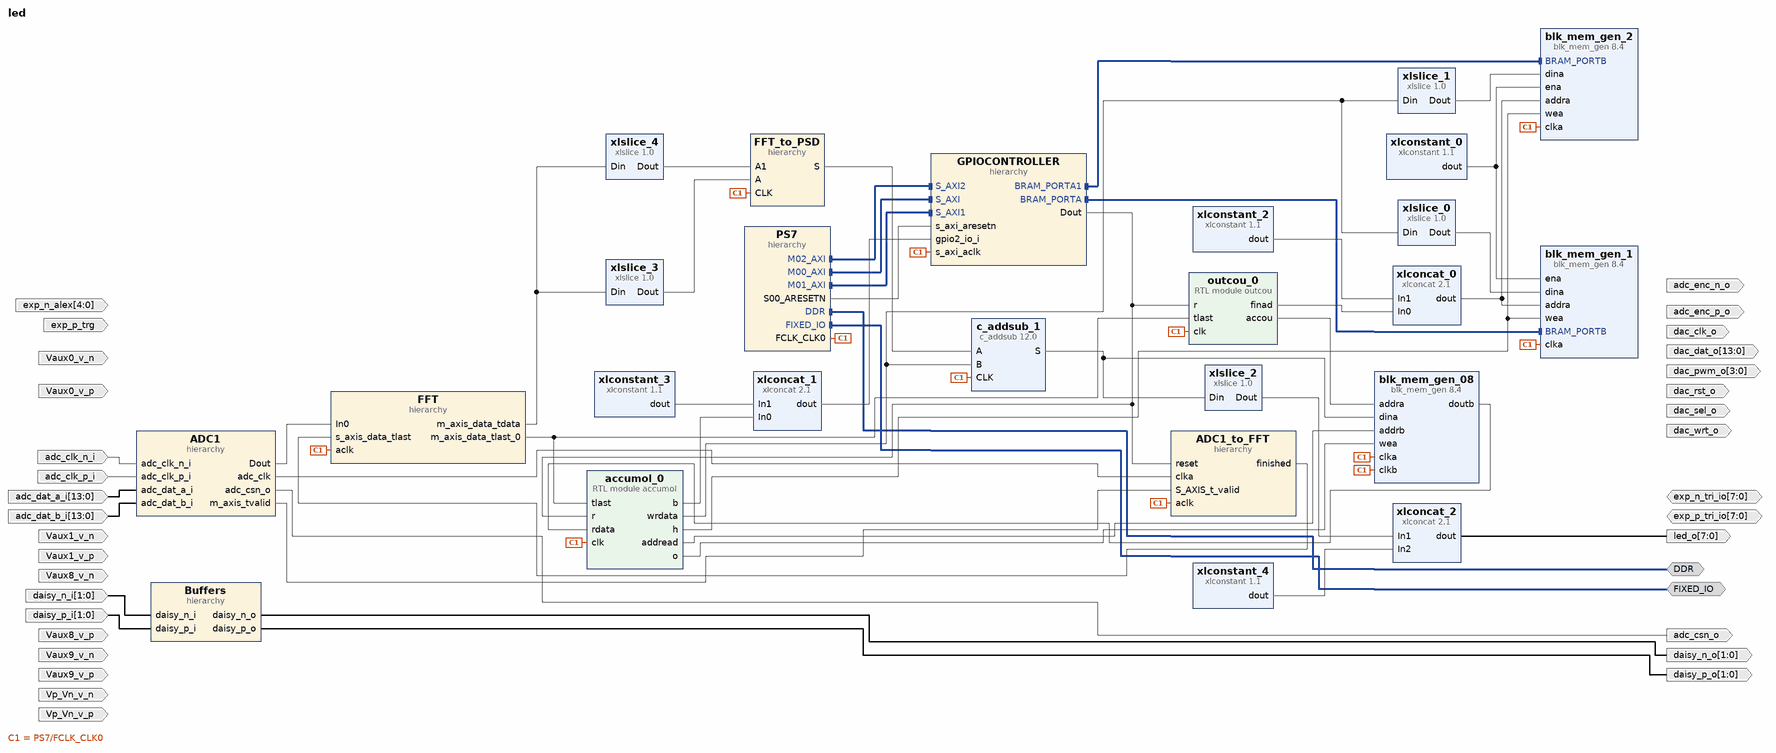
[diagram p0: block diagram of the top level]
# Vivado block design led, xc7z010clg400-1, Vivado 2024.2
create_bd_design led

create_bd_intf_port -mode Master -vlnv xilinx.com:interface:ddrx_rtl:1.0 DDR
create_bd_intf_port -mode Master -vlnv xilinx.com:display_processing_system7:fixedio_rtl:1.0 FIXED_IO
create_bd_port -dir I -from 13 -to 0 adc_dat_a_i
create_bd_port -dir I -from 13 -to 0 adc_dat_b_i
create_bd_port -dir I -type clk adc_clk_n_i
set_property -dict {CONFIG.FREQ_HZ 125000000} [get_bd_ports adc_clk_n_i]
create_bd_port -dir I -type clk adc_clk_p_i
set_property -dict {CONFIG.FREQ_HZ 125000000} [get_bd_ports adc_clk_p_i]
create_bd_port -dir I -from 1 -to 0 -type clk daisy_p_i
set_property -dict {CONFIG.FREQ_HZ 100000000} [get_bd_ports daisy_p_i]
create_bd_port -dir I -from 1 -to 0 -type clk daisy_n_i
set_property -dict {CONFIG.FREQ_HZ 100000000} [get_bd_ports daisy_n_i]
create_bd_port -dir O -from 1 -to 0 -type clk daisy_n_o
create_bd_port -dir O -from 1 -to 0 -type clk daisy_p_o
create_bd_port -dir O -from 7 -to 0 led_o
create_bd_port -dir O -from 13 -to 0 dac_dat_o
create_bd_port -dir O -from 3 -to 0 dac_pwm_o
create_bd_port -dir IO -from 7 -to 0 exp_n_tri_io
create_bd_port -dir IO -from 7 -to 0 exp_p_tri_io
create_bd_port -dir O adc_enc_n_o
create_bd_port -dir O adc_enc_p_o
create_bd_port -dir O dac_clk_o
create_bd_port -dir O dac_rst_o
create_bd_port -dir O dac_sel_o
create_bd_port -dir O dac_wrt_o
create_bd_port -dir O adc_csn_o
create_bd_port -dir I Vaux0_v_p
create_bd_port -dir I Vaux0_v_n
create_bd_port -dir I Vaux1_v_p
create_bd_port -dir I Vaux1_v_n
create_bd_port -dir I Vaux8_v_p
create_bd_port -dir I Vaux8_v_n
create_bd_port -dir I Vaux9_v_p
create_bd_port -dir I Vaux9_v_n
create_bd_port -dir I -type data Vp_Vn_v_p
create_bd_port -dir I -type data Vp_Vn_v_n
create_bd_port -dir I -type data exp_p_trg
create_bd_port -dir I -from 4 -to 0 -type data exp_n_alex

create_bd_cell -type hier PS7
create_bd_cell -type hier GPIOCONTROLLER
create_bd_cell -type hier Buffers
create_bd_cell -type hier ADC1
create_bd_cell -type hier ADC1_to_FFT
create_bd_cell -type hier FFT
create_bd_cell -type ip -vlnv xilinx.com:ip:c_addsub:12.0 c_addsub_1
set_property -dict [list \
  CONFIG.A_Width 64 \
  CONFIG.B_Value 0000000000000000000000000000000000000000000000000000000000000000 \
  CONFIG.B_Width 64 \
  CONFIG.CE false \
  CONFIG.Implementation Fabric \
  CONFIG.Latency 1 \
  CONFIG.Out_Width 64 \
] [get_bd_cells c_addsub_1]
create_bd_cell -type hier FFT_to_PSD
create_bd_cell -type ip -vlnv xilinx.com:ip:blk_mem_gen:8.4 blk_mem_gen_08
set_property -dict [list \
  CONFIG.Enable_A Always_Enabled \
  CONFIG.Enable_B Always_Enabled \
  CONFIG.Memory_Type Simple_Dual_Port_RAM \
  CONFIG.Write_Depth_A 1024 \
  CONFIG.Write_Width_A 64 \
  CONFIG.use_bram_block Stand_Alone \
] [get_bd_cells blk_mem_gen_08]
create_bd_cell -type module -reference outcou outcou_0
create_bd_cell -type ip -vlnv xilinx.com:ip:xlconcat:2.1 xlconcat_0
set_property -dict {CONFIG.IN0_WIDTH 12 CONFIG.IN1_WIDTH 20 CONFIG.IN2_WIDTH 20 CONFIG.NUM_PORTS 2} [get_bd_cells xlconcat_0]
create_bd_cell -type ip -vlnv xilinx.com:ip:xlconstant:1.1 xlconstant_0
create_bd_cell -type ip -vlnv xilinx.com:ip:xlconstant:1.1 xlconstant_2
set_property -dict {CONFIG.CONST_VAL 0 CONFIG.CONST_WIDTH 20} [get_bd_cells xlconstant_2]
create_bd_cell -type ip -vlnv xilinx.com:ip:xlconcat:2.1 xlconcat_1
set_property -dict {CONFIG.IN1_WIDTH 31} [get_bd_cells xlconcat_1]
create_bd_cell -type ip -vlnv xilinx.com:ip:xlconstant:1.1 xlconstant_3
set_property -dict {CONFIG.CONST_VAL 0 CONFIG.CONST_WIDTH 31} [get_bd_cells xlconstant_3]
create_bd_cell -type ip -vlnv xilinx.com:ip:blk_mem_gen:8.4 blk_mem_gen_1
set_property -dict [list \
  CONFIG.Memory_Type True_Dual_Port_RAM \
  CONFIG.Write_Width_A 32 \
  CONFIG.use_bram_block BRAM_Controller \
] [get_bd_cells blk_mem_gen_1]
create_bd_cell -type module -reference accumol accumol_0
create_bd_cell -type ip -vlnv xilinx.com:ip:xlslice:1.0 xlslice_2
set_property -dict {CONFIG.DIN_FROM 2 CONFIG.DIN_TO 2 CONFIG.DIN_WIDTH 64} [get_bd_cells xlslice_2]
create_bd_cell -type ip -vlnv xilinx.com:ip:xlconcat:2.1 xlconcat_2
set_property -dict {CONFIG.IN2_WIDTH 6 CONFIG.NUM_PORTS 3} [get_bd_cells xlconcat_2]
create_bd_cell -type ip -vlnv xilinx.com:ip:xlconstant:1.1 xlconstant_4
set_property -dict {CONFIG.CONST_VAL 11 CONFIG.CONST_WIDTH 6} [get_bd_cells xlconstant_4]
create_bd_cell -type ip -vlnv xilinx.com:ip:xlslice:1.0 xlslice_3
set_property -dict {CONFIG.DIN_FROM 31 CONFIG.DIN_WIDTH 64} [get_bd_cells xlslice_3]
create_bd_cell -type ip -vlnv xilinx.com:ip:xlslice:1.0 xlslice_4
set_property -dict {CONFIG.DIN_FROM 63 CONFIG.DIN_TO 32 CONFIG.DIN_WIDTH 64} [get_bd_cells xlslice_4]
create_bd_cell -type ip -vlnv xilinx.com:ip:xlslice:1.0 xlslice_0
set_property -dict {CONFIG.DIN_FROM 31 CONFIG.DIN_WIDTH 64} [get_bd_cells xlslice_0]
create_bd_cell -type ip -vlnv xilinx.com:ip:xlslice:1.0 xlslice_1
set_property -dict {CONFIG.DIN_FROM 63 CONFIG.DIN_TO 32 CONFIG.DIN_WIDTH 64} [get_bd_cells xlslice_1]
create_bd_cell -type ip -vlnv xilinx.com:ip:blk_mem_gen:8.4 blk_mem_gen_2
set_property -dict [list \
  CONFIG.Memory_Type True_Dual_Port_RAM \
  CONFIG.Write_Width_A 32 \
  CONFIG.use_bram_block BRAM_Controller \
] [get_bd_cells blk_mem_gen_2]

# ---- hierarchy /PS7 ----
current_bd_instance /PS7
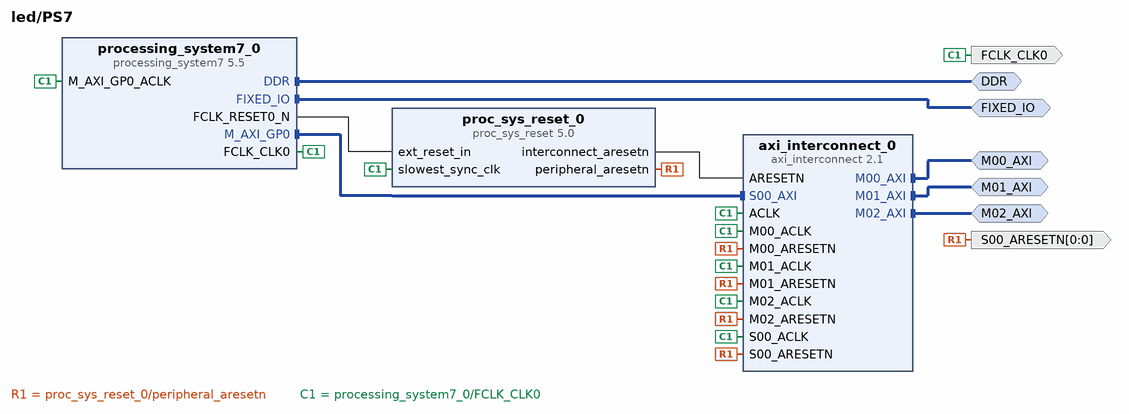
[diagram p1: block diagram inside /PS7]
create_bd_intf_pin -mode Master -vlnv xilinx.com:interface:ddrx_rtl:1.0 DDR
create_bd_intf_pin -mode Master -vlnv xilinx.com:display_processing_system7:fixedio_rtl:1.0 FIXED_IO
create_bd_intf_pin -mode Master -vlnv xilinx.com:interface:aximm_rtl:1.0 M00_AXI
create_bd_intf_pin -mode Master -vlnv xilinx.com:interface:aximm_rtl:1.0 M01_AXI
create_bd_intf_pin -mode Master -vlnv xilinx.com:interface:aximm_rtl:1.0 M02_AXI
create_bd_pin -dir O -type clk FCLK_CLK0
create_bd_pin -dir O -from 0 -to 0 -type rst S00_ARESETN

create_bd_cell -type ip -vlnv xilinx.com:ip:proc_sys_reset:5.0 proc_sys_reset_0
create_bd_cell -type ip -vlnv xilinx.com:ip:processing_system7:5.5 processing_system7_0
set_property -dict [list \
  CONFIG.PCW_FPGA0_PERIPHERAL_FREQMHZ 125 \
  CONFIG.PCW_FPGA1_PERIPHERAL_FREQMHZ 125 \
  CONFIG.PCW_UIPARAM_DDR_FREQ_MHZ 533.333333 \
  CONFIG.PCW_UIPARAM_DDR_MEMORY_TYPE {DDR 3 (Low Voltage)} \
  CONFIG.PCW_UIPARAM_DDR_PARTNO {MT41K256M16 RE-125} \
] [get_bd_cells processing_system7_0]
# 33 more settings of processing_system7_0 are not shown: defaults, MIO pin electricals, DDR timing, and values the tool derives
create_bd_cell -type ip -vlnv xilinx.com:ip:axi_interconnect:2.1 axi_interconnect_0
set_property -dict {CONFIG.NUM_MI 3} [get_bd_cells axi_interconnect_0]

# ---- hierarchy /GPIOCONTROLLER ----
current_bd_instance /GPIOCONTROLLER
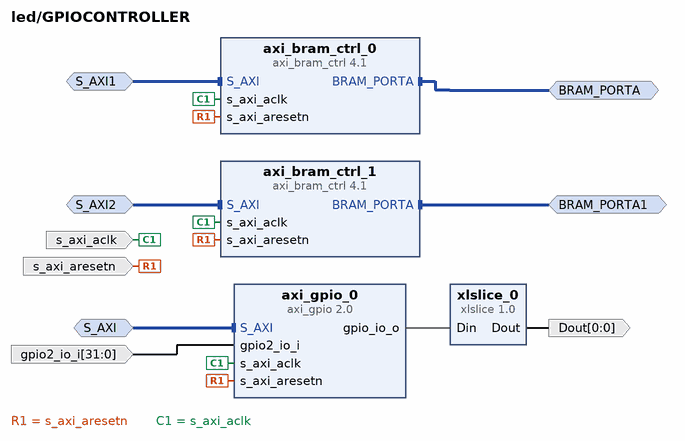
[diagram p2: block diagram inside /GPIOCONTROLLER]
create_bd_intf_pin -mode Slave -vlnv xilinx.com:interface:aximm_rtl:1.0 S_AXI
create_bd_intf_pin -mode Slave -vlnv xilinx.com:interface:aximm_rtl:1.0 S_AXI1
create_bd_intf_pin -mode Master -vlnv xilinx.com:interface:bram_rtl:1.0 BRAM_PORTA
create_bd_intf_pin -mode Slave -vlnv xilinx.com:interface:aximm_rtl:1.0 S_AXI2
create_bd_intf_pin -mode Master -vlnv xilinx.com:interface:bram_rtl:1.0 BRAM_PORTA1
create_bd_pin -dir I -type clk s_axi_aclk
create_bd_pin -dir I -type rst s_axi_aresetn
create_bd_pin -dir I -from 31 -to 0 gpio2_io_i
create_bd_pin -dir O -from 0 -to 0 Dout

create_bd_cell -type ip -vlnv xilinx.com:ip:axi_gpio:2.0 axi_gpio_0
set_property -dict [list \
  CONFIG.C_ALL_INPUTS 0 \
  CONFIG.C_ALL_INPUTS_2 1 \
  CONFIG.C_ALL_OUTPUTS 1 \
  CONFIG.C_GPIO_WIDTH 32 \
  CONFIG.C_IS_DUAL 1 \
  CONFIG.GPIO_BOARD_INTERFACE Custom \
  CONFIG.USE_BOARD_FLOW true \
] [get_bd_cells axi_gpio_0]
create_bd_cell -type ip -vlnv xilinx.com:ip:axi_bram_ctrl:4.1 axi_bram_ctrl_0
set_property -dict {CONFIG.DATA_WIDTH 32 CONFIG.SINGLE_PORT_BRAM 1} [get_bd_cells axi_bram_ctrl_0]
create_bd_cell -type ip -vlnv xilinx.com:ip:xlslice:1.0 xlslice_0
create_bd_cell -type ip -vlnv xilinx.com:ip:axi_bram_ctrl:4.1 axi_bram_ctrl_1
set_property -dict {CONFIG.DATA_WIDTH 32 CONFIG.SINGLE_PORT_BRAM 1} [get_bd_cells axi_bram_ctrl_1]

# ---- hierarchy /Buffers ----
current_bd_instance /Buffers
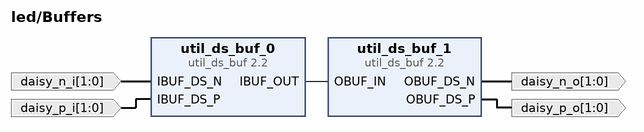
[diagram p3: block diagram inside /Buffers]
create_bd_pin -dir I -from 1 -to 0 -type clk daisy_p_i
create_bd_pin -dir I -from 1 -to 0 -type clk daisy_n_i
create_bd_pin -dir O -from 1 -to 0 -type clk daisy_p_o
create_bd_pin -dir O -from 1 -to 0 -type clk daisy_n_o

create_bd_cell -type ip -vlnv xilinx.com:ip:util_ds_buf:2.2 util_ds_buf_0
set_property -dict {CONFIG.C_SIZE 2} [get_bd_cells util_ds_buf_0]
create_bd_cell -type ip -vlnv xilinx.com:ip:util_ds_buf:2.2 util_ds_buf_1
set_property -dict {CONFIG.C_BUF_TYPE OBUFDS CONFIG.C_SIZE 2} [get_bd_cells util_ds_buf_1]

# ---- hierarchy /ADC1 ----
current_bd_instance /ADC1
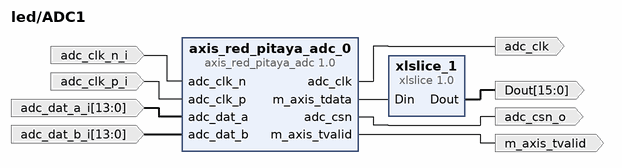
[diagram p4: block diagram inside /ADC1]
create_bd_pin -dir O -type clk adc_clk
create_bd_pin -dir O adc_csn_o
create_bd_pin -dir I -type clk adc_clk_p_i
create_bd_pin -dir I -type clk adc_clk_n_i
create_bd_pin -dir I -from 13 -to 0 adc_dat_a_i
create_bd_pin -dir I -from 13 -to 0 adc_dat_b_i
create_bd_pin -dir O m_axis_tvalid
create_bd_pin -dir O -from 15 -to 0 Dout

create_bd_cell -type ip -vlnv user.org:user:axis_red_pitaya_adc:1.0 axis_red_pitaya_adc_0
create_bd_cell -type ip -vlnv xilinx.com:ip:xlslice:1.0 xlslice_1
set_property -dict {CONFIG.DIN_FROM 31 CONFIG.DIN_TO 16} [get_bd_cells xlslice_1]

# ---- hierarchy /ADC1_to_FFT ----
current_bd_instance /ADC1_to_FFT
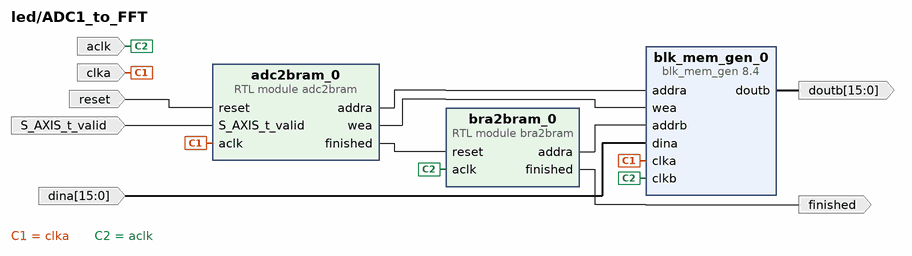
[diagram p5: block diagram inside /ADC1_to_FFT]
create_bd_pin -dir I -type rst reset
create_bd_pin -dir I S_AXIS_t_valid
create_bd_pin -dir I -type clk clka
create_bd_pin -dir I -from 15 -to 0 dina
create_bd_pin -dir I -type clk aclk
create_bd_pin -dir O -from 15 -to 0 doutb
create_bd_pin -dir O finished

create_bd_cell -type module -reference adc2bram adc2bram_0
create_bd_cell -type ip -vlnv xilinx.com:ip:blk_mem_gen:8.4 blk_mem_gen_0
set_property -dict [list \
  CONFIG.Enable_A Always_Enabled \
  CONFIG.Enable_B Always_Enabled \
  CONFIG.Memory_Type Simple_Dual_Port_RAM \
  CONFIG.Write_Depth_A 1024 \
  CONFIG.Write_Width_A 16 \
  CONFIG.use_bram_block Stand_Alone \
] [get_bd_cells blk_mem_gen_0]
create_bd_cell -type module -reference bra2bram bra2bram_0

# ---- hierarchy /FFT ----
current_bd_instance /FFT
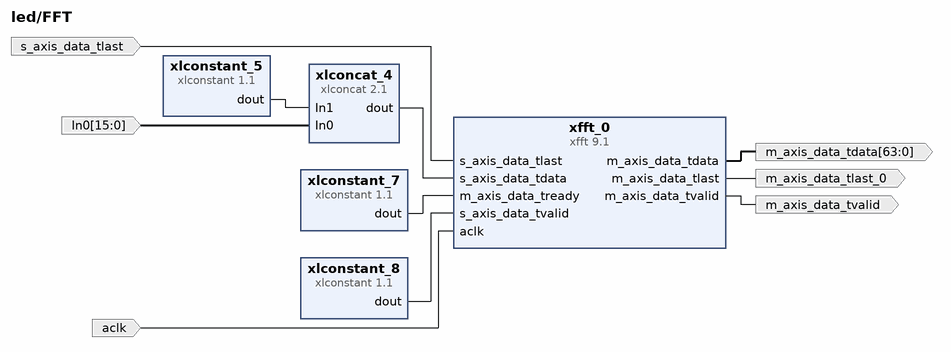
[diagram p6: block diagram inside /FFT]
create_bd_pin -dir I -type clk aclk
create_bd_pin -dir I s_axis_data_tlast
create_bd_pin -dir O -from 63 -to 0 m_axis_data_tdata
create_bd_pin -dir O m_axis_data_tvalid
create_bd_pin -dir I -from 15 -to 0 In0
create_bd_pin -dir O m_axis_data_tlast_0

create_bd_cell -type ip -vlnv xilinx.com:ip:xfft:9.1 xfft_0
set_property -dict [list \
  CONFIG.implementation_options pipelined_streaming_io \
  CONFIG.input_width 14 \
  CONFIG.number_of_stages_using_block_ram_for_data_and_phase_factors 3 \
  CONFIG.output_ordering natural_order \
  CONFIG.phase_factor_width 16 \
  CONFIG.scaling_options unscaled \
  CONFIG.target_clock_frequency 125 \
] [get_bd_cells xfft_0]
create_bd_cell -type ip -vlnv xilinx.com:ip:xlconcat:2.1 xlconcat_4
set_property -dict {CONFIG.IN0_WIDTH 16 CONFIG.IN1_WIDTH 16} [get_bd_cells xlconcat_4]
create_bd_cell -type ip -vlnv xilinx.com:ip:xlconstant:1.1 xlconstant_5
set_property -dict {CONFIG.CONST_VAL 0 CONFIG.CONST_WIDTH 16} [get_bd_cells xlconstant_5]
create_bd_cell -type ip -vlnv xilinx.com:ip:xlconstant:1.1 xlconstant_7
create_bd_cell -type ip -vlnv xilinx.com:ip:xlconstant:1.1 xlconstant_8

# ---- hierarchy /FFT_to_PSD ----
current_bd_instance /FFT_to_PSD
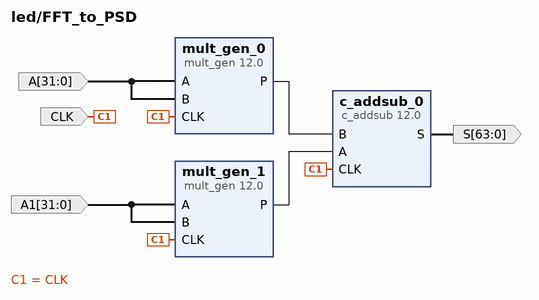
[diagram p7: block diagram inside /FFT_to_PSD]
create_bd_pin -dir I -type clk CLK
create_bd_pin -dir O -from 63 -to 0 -type data S
create_bd_pin -dir I -from 31 -to 0 -type data A
create_bd_pin -dir I -from 31 -to 0 -type data A1

create_bd_cell -type ip -vlnv xilinx.com:ip:c_addsub:12.0 c_addsub_0
set_property -dict [list \
  CONFIG.A_Width 64 \
  CONFIG.B_Value 0000000000000000000000000000000000000000000000000000000000000000 \
  CONFIG.B_Width 64 \
  CONFIG.CE false \
  CONFIG.Implementation Fabric \
  CONFIG.Latency 1 \
  CONFIG.Out_Width 64 \
] [get_bd_cells c_addsub_0]
create_bd_cell -type ip -vlnv xilinx.com:ip:mult_gen:12.0 mult_gen_0
set_property -dict [list \
  CONFIG.Multiplier_Construction Use_Mults \
  CONFIG.OptGoal Speed \
  CONFIG.PortAWidth 32 \
  CONFIG.PortBWidth 32 \
] [get_bd_cells mult_gen_0]
create_bd_cell -type ip -vlnv xilinx.com:ip:mult_gen:12.0 mult_gen_1
set_property -dict [list \
  CONFIG.Multiplier_Construction Use_Mults \
  CONFIG.OptGoal Speed \
  CONFIG.PortAWidth 32 \
  CONFIG.PortBWidth 32 \
] [get_bd_cells mult_gen_1]

# ---- connections ----

current_bd_instance /PS7
connect_bd_intf_net [get_bd_intf_pins M00_AXI] [get_bd_intf_pins axi_interconnect_0/M00_AXI]
connect_bd_intf_net [get_bd_intf_pins M01_AXI] [get_bd_intf_pins axi_interconnect_0/M01_AXI]
connect_bd_intf_net [get_bd_intf_pins M02_AXI] [get_bd_intf_pins axi_interconnect_0/M02_AXI]
connect_bd_intf_net [get_bd_intf_pins DDR] [get_bd_intf_pins processing_system7_0/DDR]
connect_bd_intf_net [get_bd_intf_pins FIXED_IO] [get_bd_intf_pins processing_system7_0/FIXED_IO]
connect_bd_intf_net [get_bd_intf_pins processing_system7_0/M_AXI_GP0] [get_bd_intf_pins axi_interconnect_0/S00_AXI]
connect_bd_net [get_bd_pins proc_sys_reset_0/interconnect_aresetn] [get_bd_pins axi_interconnect_0/ARESETN]
connect_bd_net [get_bd_pins proc_sys_reset_0/peripheral_aresetn] \
  [get_bd_pins S00_ARESETN] [get_bd_pins axi_interconnect_0/S00_ARESETN] [get_bd_pins axi_interconnect_0/M00_ARESETN] \
  [get_bd_pins axi_interconnect_0/M01_ARESETN] [get_bd_pins axi_interconnect_0/M02_ARESETN]
connect_bd_net [get_bd_pins processing_system7_0/FCLK_CLK0] \
  [get_bd_pins processing_system7_0/M_AXI_GP0_ACLK] [get_bd_pins axi_interconnect_0/S00_ACLK] \
  [get_bd_pins axi_interconnect_0/M00_ACLK] [get_bd_pins axi_interconnect_0/ACLK] [get_bd_pins axi_interconnect_0/M01_ACLK] \
  [get_bd_pins proc_sys_reset_0/slowest_sync_clk] [get_bd_pins FCLK_CLK0] [get_bd_pins axi_interconnect_0/M02_ACLK]
connect_bd_net [get_bd_pins processing_system7_0/FCLK_RESET0_N] [get_bd_pins proc_sys_reset_0/ext_reset_in]
set_property HDL_ATTRIBUTE.BMM_INFO_PROCESSOR {arm > led GPIOCONTROLLER/axi_bram_ctrl_0 led GPIOCONTROLLER/axi_bram_ctrl_1} [get_bd_cells processing_system7_0]
set_property HDL_ATTRIBUTE.KEEP_HIERARCHY yes [get_bd_cells processing_system7_0]

current_bd_instance /GPIOCONTROLLER
connect_bd_intf_net [get_bd_intf_pins axi_bram_ctrl_1/BRAM_PORTA] [get_bd_intf_pins BRAM_PORTA1]
connect_bd_intf_net -intf_net S_AXI2_1 [get_bd_intf_pins S_AXI2] [get_bd_intf_pins axi_bram_ctrl_1/S_AXI]
connect_bd_intf_net [get_bd_intf_pins BRAM_PORTA] [get_bd_intf_pins axi_bram_ctrl_0/BRAM_PORTA]
connect_bd_intf_net -intf_net axi_interconnect_0_M00_AXI [get_bd_intf_pins S_AXI] [get_bd_intf_pins axi_gpio_0/S_AXI]
connect_bd_intf_net -intf_net axi_interconnect_0_M01_AXI [get_bd_intf_pins S_AXI1] [get_bd_intf_pins axi_bram_ctrl_0/S_AXI]
connect_bd_net [get_bd_pins axi_gpio_0/gpio_io_o] [get_bd_pins xlslice_0/Din]
connect_bd_net -net proc_sys_reset_0_peripheral_aresetn [get_bd_pins s_axi_aresetn] \
  [get_bd_pins axi_bram_ctrl_0/s_axi_aresetn] [get_bd_pins axi_gpio_0/s_axi_aresetn] \
  [get_bd_pins axi_bram_ctrl_1/s_axi_aresetn]
connect_bd_net -net processing_system7_0_FCLK_CLK0 [get_bd_pins s_axi_aclk] \
  [get_bd_pins axi_bram_ctrl_0/s_axi_aclk] [get_bd_pins axi_gpio_0/s_axi_aclk] [get_bd_pins axi_bram_ctrl_1/s_axi_aclk]
connect_bd_net -net xlconcat_0_dout [get_bd_pins gpio2_io_i] [get_bd_pins axi_gpio_0/gpio2_io_i]
connect_bd_net [get_bd_pins xlslice_0/Dout] [get_bd_pins Dout]
set_property HDL_ATTRIBUTE.BMM_INFO_ADDRESS_SPACE {byte  0x40000000 32 > led blk_mem_gen_1} [get_bd_cells axi_bram_ctrl_0]
set_property HDL_ATTRIBUTE.KEEP_HIERARCHY yes [get_bd_cells axi_bram_ctrl_0]
set_property HDL_ATTRIBUTE.BMM_INFO_ADDRESS_SPACE {byte  0x42000000 32 > led blk_mem_gen_2} [get_bd_cells axi_bram_ctrl_1]
set_property HDL_ATTRIBUTE.KEEP_HIERARCHY yes [get_bd_cells axi_bram_ctrl_1]

current_bd_instance /Buffers
connect_bd_net [get_bd_pins daisy_n_i] [get_bd_pins util_ds_buf_0/IBUF_DS_N]
connect_bd_net -net daisy_n_o_1 [get_bd_pins util_ds_buf_1/OBUF_DS_N] [get_bd_pins daisy_n_o]
connect_bd_net [get_bd_pins daisy_p_i] [get_bd_pins util_ds_buf_0/IBUF_DS_P]
connect_bd_net -net daisy_p_o_1 [get_bd_pins util_ds_buf_1/OBUF_DS_P] [get_bd_pins daisy_p_o]
connect_bd_net [get_bd_pins util_ds_buf_0/IBUF_OUT] [get_bd_pins util_ds_buf_1/OBUF_IN]

current_bd_instance /ADC1
connect_bd_net -net adc_clk_n_0_1 [get_bd_pins adc_clk_n_i] [get_bd_pins axis_red_pitaya_adc_0/adc_clk_n]
connect_bd_net -net adc_clk_p_0_1 [get_bd_pins adc_clk_p_i] [get_bd_pins axis_red_pitaya_adc_0/adc_clk_p]
connect_bd_net [get_bd_pins adc_dat_a_i] [get_bd_pins axis_red_pitaya_adc_0/adc_dat_a]
connect_bd_net [get_bd_pins adc_dat_b_i] [get_bd_pins axis_red_pitaya_adc_0/adc_dat_b]
connect_bd_net [get_bd_pins axis_red_pitaya_adc_0/adc_clk] [get_bd_pins adc_clk]
connect_bd_net [get_bd_pins axis_red_pitaya_adc_0/adc_csn] [get_bd_pins adc_csn_o]
connect_bd_net [get_bd_pins axis_red_pitaya_adc_0/m_axis_tdata] [get_bd_pins xlslice_1/Din]
connect_bd_net [get_bd_pins axis_red_pitaya_adc_0/m_axis_tvalid] [get_bd_pins m_axis_tvalid]
connect_bd_net [get_bd_pins xlslice_1/Dout] [get_bd_pins Dout]

current_bd_instance /ADC1_to_FFT
connect_bd_net -net GPIOCONTROLLER_Dout [get_bd_pins reset] [get_bd_pins adc2bram_0/reset]
connect_bd_net [get_bd_pins adc2bram_0/addra] [get_bd_pins blk_mem_gen_0/addra]
connect_bd_net [get_bd_pins adc2bram_0/finished] [get_bd_pins bra2bram_0/reset]
connect_bd_net [get_bd_pins adc2bram_0/wea] [get_bd_pins blk_mem_gen_0/wea]
connect_bd_net -net axis_red_pitaya_adc_0_adc_clk [get_bd_pins clka] [get_bd_pins blk_mem_gen_0/clka] [get_bd_pins adc2bram_0/aclk]
connect_bd_net -net axis_red_pitaya_adc_0_m_axis_tvalid [get_bd_pins S_AXIS_t_valid] [get_bd_pins adc2bram_0/S_AXIS_t_valid]
connect_bd_net [get_bd_pins blk_mem_gen_0/doutb] [get_bd_pins doutb]
connect_bd_net [get_bd_pins bra2bram_0/addra] [get_bd_pins blk_mem_gen_0/addrb]
connect_bd_net [get_bd_pins bra2bram_0/finished] [get_bd_pins finished]
connect_bd_net -net processing_system7_0_FCLK_CLK0 [get_bd_pins aclk] [get_bd_pins blk_mem_gen_0/clkb] [get_bd_pins bra2bram_0/aclk]
connect_bd_net -net xlslice_1_Dout [get_bd_pins dina] [get_bd_pins blk_mem_gen_0/dina]

current_bd_instance /FFT
connect_bd_net -net In0_1 [get_bd_pins In0] [get_bd_pins xlconcat_4/In0]
connect_bd_net -net bra2bram_0_finished [get_bd_pins s_axis_data_tlast] [get_bd_pins xfft_0/s_axis_data_tlast]
connect_bd_net -net processing_system7_0_FCLK_CLK0 [get_bd_pins aclk] [get_bd_pins xfft_0/aclk]
connect_bd_net [get_bd_pins xfft_0/m_axis_data_tdata] [get_bd_pins m_axis_data_tdata]
connect_bd_net [get_bd_pins xfft_0/m_axis_data_tlast] [get_bd_pins m_axis_data_tlast_0]
connect_bd_net [get_bd_pins xfft_0/m_axis_data_tvalid] [get_bd_pins m_axis_data_tvalid]
connect_bd_net [get_bd_pins xlconcat_4/dout] [get_bd_pins xfft_0/s_axis_data_tdata]
connect_bd_net [get_bd_pins xlconstant_5/dout] [get_bd_pins xlconcat_4/In1]
connect_bd_net [get_bd_pins xlconstant_7/dout] [get_bd_pins xfft_0/m_axis_data_tready]
connect_bd_net [get_bd_pins xlconstant_8/dout] [get_bd_pins xfft_0/s_axis_data_tvalid]

current_bd_instance /FFT_to_PSD
connect_bd_net -net axis_red_pitaya_adc_0_adc_clk [get_bd_pins CLK] \
  [get_bd_pins mult_gen_0/CLK] [get_bd_pins mult_gen_1/CLK] [get_bd_pins c_addsub_0/CLK]
connect_bd_net [get_bd_pins c_addsub_0/S] [get_bd_pins S]
connect_bd_net [get_bd_pins mult_gen_0/P] [get_bd_pins c_addsub_0/B]
connect_bd_net [get_bd_pins mult_gen_1/P] [get_bd_pins c_addsub_0/A]
connect_bd_net -net xfft_0_m_axis_data_tdata [get_bd_pins A] [get_bd_pins mult_gen_0/A] [get_bd_pins mult_gen_0/B]
connect_bd_net -net xlslice_3_Dout [get_bd_pins A1] [get_bd_pins mult_gen_1/A] [get_bd_pins mult_gen_1/B]

current_bd_instance /
connect_bd_intf_net [get_bd_intf_pins blk_mem_gen_1/BRAM_PORTB] [get_bd_intf_pins GPIOCONTROLLER/BRAM_PORTA]
connect_bd_intf_net [get_bd_intf_pins blk_mem_gen_2/BRAM_PORTB] [get_bd_intf_pins GPIOCONTROLLER/BRAM_PORTA1]
connect_bd_intf_net -intf_net S_AXI2_1 [get_bd_intf_pins GPIOCONTROLLER/S_AXI2] [get_bd_intf_pins PS7/M02_AXI]
connect_bd_intf_net -intf_net axi_interconnect_0_M00_AXI [get_bd_intf_pins PS7/M00_AXI] [get_bd_intf_pins GPIOCONTROLLER/S_AXI]
connect_bd_intf_net -intf_net axi_interconnect_0_M01_AXI [get_bd_intf_pins PS7/M01_AXI] [get_bd_intf_pins GPIOCONTROLLER/S_AXI1]
connect_bd_intf_net -intf_net processing_system7_0_DDR [get_bd_intf_ports DDR] [get_bd_intf_pins PS7/DDR]
connect_bd_intf_net -intf_net processing_system7_0_FIXED_IO [get_bd_intf_ports FIXED_IO] [get_bd_intf_pins PS7/FIXED_IO]
connect_bd_net [get_bd_pins ADC1/Dout] [get_bd_pins FFT/In0]
connect_bd_net [get_bd_pins FFT/m_axis_data_tdata] [get_bd_pins xlslice_3/Din] [get_bd_pins xlslice_4/Din]
connect_bd_net [get_bd_pins FFT_to_PSD/S] [get_bd_pins c_addsub_1/A]
connect_bd_net [get_bd_pins GPIOCONTROLLER/Dout] [get_bd_pins ADC1_to_FFT/reset] [get_bd_pins outcou_0/r] [get_bd_pins accumol_0/r]
connect_bd_net -net accum_0_addread [get_bd_pins accumol_0/addread] [get_bd_pins blk_mem_gen_08/addrb]
connect_bd_net -net accum_0_f [get_bd_pins accumol_0/h] [get_bd_pins blk_mem_gen_1/wea] [get_bd_pins blk_mem_gen_2/wea]
connect_bd_net [get_bd_pins accumol_0/b] [get_bd_pins xlconcat_1/In0]
connect_bd_net [get_bd_pins accumol_0/o] [get_bd_pins blk_mem_gen_08/wea]
connect_bd_net [get_bd_pins accumol_0/wrdata] [get_bd_pins xlslice_1/Din] [get_bd_pins xlslice_0/Din] [get_bd_pins c_addsub_1/B]
connect_bd_net -net adc_clk_n_0_1 [get_bd_ports adc_clk_n_i] [get_bd_pins ADC1/adc_clk_n_i]
connect_bd_net -net adc_clk_p_0_1 [get_bd_ports adc_clk_p_i] [get_bd_pins ADC1/adc_clk_p_i]
connect_bd_net [get_bd_ports adc_dat_a_i] [get_bd_pins ADC1/adc_dat_a_i]
connect_bd_net [get_bd_ports adc_dat_b_i] [get_bd_pins ADC1/adc_dat_b_i]
connect_bd_net -net axis_red_pitaya_adc_0_adc_clk [get_bd_pins ADC1/adc_clk] [get_bd_pins ADC1_to_FFT/clka]
connect_bd_net -net axis_red_pitaya_adc_0_adc_csn [get_bd_pins ADC1/adc_csn_o] [get_bd_ports adc_csn_o]
connect_bd_net -net axis_red_pitaya_adc_0_m_axis_tvalid [get_bd_pins ADC1/m_axis_tvalid] [get_bd_pins ADC1_to_FFT/S_AXIS_t_valid]
connect_bd_net -net blk_mem_gen_0_doutb1 [get_bd_pins blk_mem_gen_08/doutb] [get_bd_pins accumol_0/rdata]
connect_bd_net -net bra2bram_0_finished [get_bd_pins ADC1_to_FFT/finished] [get_bd_pins FFT/s_axis_data_tlast]
connect_bd_net [get_bd_pins c_addsub_1/S] [get_bd_pins xlslice_2/Din] [get_bd_pins blk_mem_gen_08/dina]
connect_bd_net [get_bd_ports daisy_n_i] [get_bd_pins Buffers/daisy_n_i]
connect_bd_net -net daisy_n_o_1 [get_bd_pins Buffers/daisy_n_o] [get_bd_ports daisy_n_o]
connect_bd_net [get_bd_ports daisy_p_i] [get_bd_pins Buffers/daisy_p_i]
connect_bd_net -net daisy_p_o_1 [get_bd_pins Buffers/daisy_p_o] [get_bd_ports daisy_p_o]
connect_bd_net [get_bd_pins outcou_0/accou] [get_bd_pins blk_mem_gen_08/addra]
connect_bd_net [get_bd_pins outcou_0/finad] [get_bd_pins xlconcat_0/In0]
connect_bd_net -net ppp_0_tl [get_bd_pins FFT/m_axis_data_tlast_0] [get_bd_pins outcou_0/tlast] [get_bd_pins accumol_0/tlast]
connect_bd_net -net proc_sys_reset_0_peripheral_aresetn [get_bd_pins PS7/S00_ARESETN] [get_bd_pins GPIOCONTROLLER/s_axi_aresetn]
connect_bd_net -net processing_system7_0_FCLK_CLK0 [get_bd_pins PS7/FCLK_CLK0] \
  [get_bd_pins GPIOCONTROLLER/s_axi_aclk] [get_bd_pins blk_mem_gen_08/clkb] [get_bd_pins blk_mem_gen_08/clka] \
  [get_bd_pins blk_mem_gen_1/clka] [get_bd_pins FFT_to_PSD/CLK] [get_bd_pins c_addsub_1/CLK] [get_bd_pins ADC1_to_FFT/aclk] \
  [get_bd_pins FFT/aclk] [get_bd_pins blk_mem_gen_2/clka] [get_bd_pins outcou_0/clk] [get_bd_pins accumol_0/clk]
connect_bd_net [get_bd_pins xlconcat_0/dout] [get_bd_pins blk_mem_gen_1/addra] [get_bd_pins blk_mem_gen_2/addra]
connect_bd_net [get_bd_pins xlconcat_1/dout] [get_bd_pins GPIOCONTROLLER/gpio2_io_i]
connect_bd_net [get_bd_pins xlconcat_2/dout] [get_bd_ports led_o]
connect_bd_net [get_bd_pins xlconstant_0/dout] [get_bd_pins blk_mem_gen_1/ena] [get_bd_pins blk_mem_gen_2/ena]
connect_bd_net [get_bd_pins xlconstant_2/dout] [get_bd_pins xlconcat_0/In1]
connect_bd_net [get_bd_pins xlconstant_3/dout] [get_bd_pins xlconcat_1/In1]
connect_bd_net [get_bd_pins xlconstant_4/dout] [get_bd_pins xlconcat_2/In2]
connect_bd_net [get_bd_pins xlslice_0/Dout] [get_bd_pins blk_mem_gen_1/dina]
connect_bd_net [get_bd_pins xlslice_1/Dout] [get_bd_pins blk_mem_gen_2/dina]
connect_bd_net [get_bd_pins xlslice_2/Dout] [get_bd_pins xlconcat_2/In1]
connect_bd_net [get_bd_pins xlslice_3/Dout] [get_bd_pins FFT_to_PSD/A]
connect_bd_net [get_bd_pins xlslice_4/Dout] [get_bd_pins FFT_to_PSD/A1]

# ---- address map ----
assign_bd_address -offset 0x40000000 -range 8K -target_address_space [get_bd_addr_spaces PS7/processing_system7_0/Data] [get_bd_addr_segs GPIOCONTROLLER/axi_bram_ctrl_0/S_AXI/Mem0]
assign_bd_address -offset 0x41200000 -range 4K -target_address_space [get_bd_addr_spaces PS7/processing_system7_0/Data] [get_bd_addr_segs GPIOCONTROLLER/axi_gpio_0/S_AXI/Reg]
assign_bd_address -offset 0x42000000 -range 8K -target_address_space [get_bd_addr_spaces PS7/processing_system7_0/Data] [get_bd_addr_segs GPIOCONTROLLER/axi_bram_ctrl_1/S_AXI/Mem0]

validate_bd_design
save_bd_design
